# EAGLE schematic capacitance_touch_project (EAGLE 9.6.2)
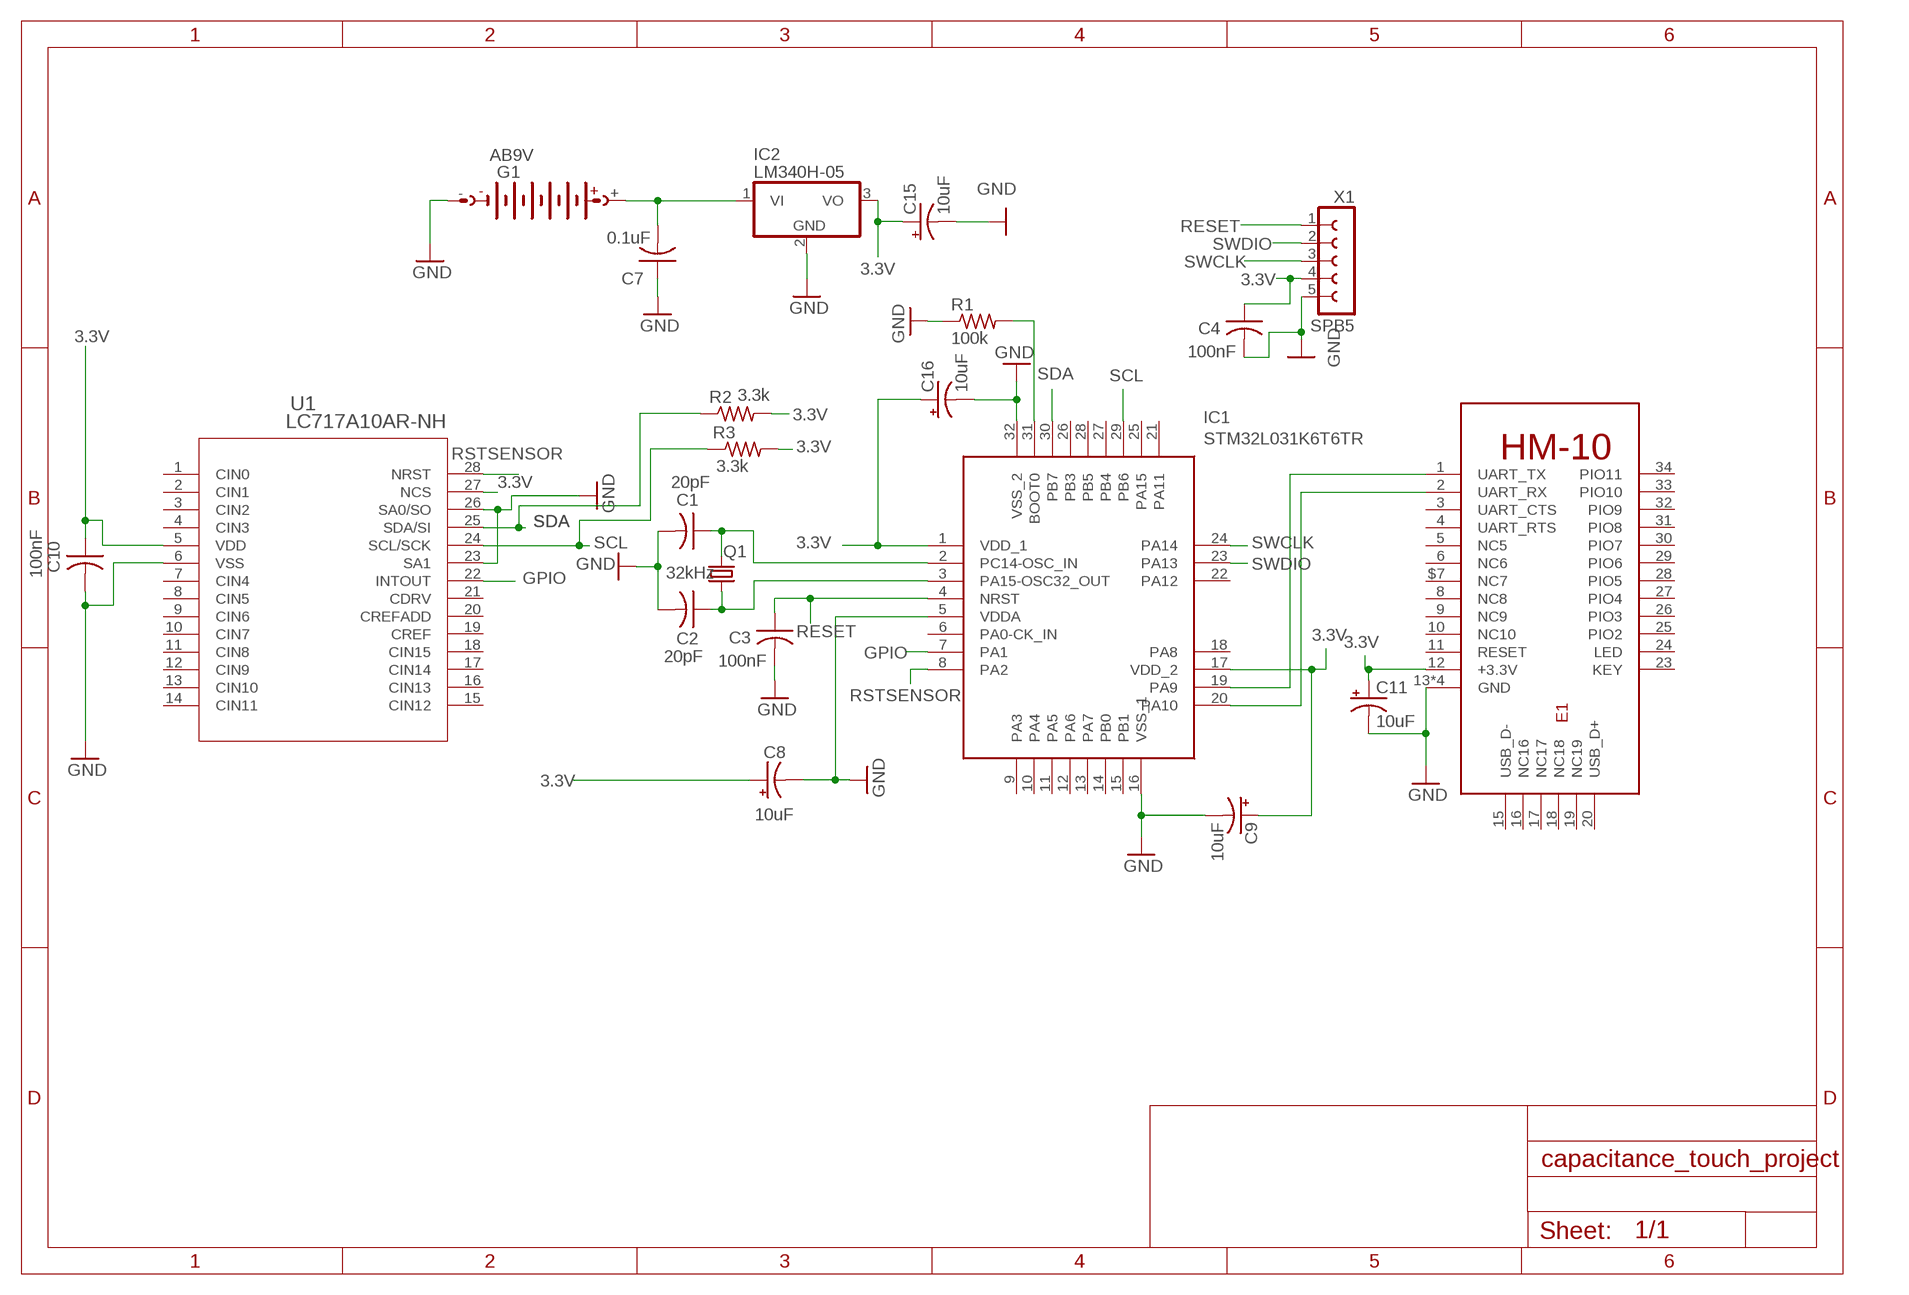
[diagram p0: schematic, sheet 1]

## Parts
C1  20pF  C-USC0805  [C0805]
C2  20pF  C-USC0805  [C0805]
C3  100nF  C-USC0805  [C0805]
C4  100nF  C-USC0805  [C0805]
C7  0.1uF  C-USC0805  [C0805]
C8  10uF  CPOL-USE2-5  [E2-5]
C9  10uF  CPOL-USE2-5  [E2-5]
C10  100nF  C-USC0805  [C0805]
C11  10uF  CPOL-USE2-5  [E2-5]
C15  10uF  CPOL-USE2-5  [E2-5]
C16  10uF  CPOL-USE2-5  [E2-5]
E1  HM-10-BOARD  [26.9X13X2.2_BOARD]
G1  AB9V  [AB9V]
IC1  STM32L031K6T6TR  [QFP80P900X900X160-32N]
IC2  LM340H-05  [TO220H]
Q1  32kHz  CRYSTALHC49S  [HC49/S]
R1  100k  R-US_0204/7  [0204/7]
R2  3.3k  R-US_0204/7  [0204/7]
R3  3.3k  R-US_0204/7  [0204/7]
U1  LC717A10AR-NH  [VCT28_3P5X3P5_ONS]
X1  SPB5  [SPB5]

## Nets
3.3V: C4.1 C8.+ C9.+ C10.1 C11.+ C15.+ C16.+ E1.12(+3.3V) IC1.1(VDD_1) IC1.17(VDD_2) IC2.3(VO) R2.2 R3.2 U1.5(VDD) U1.27(NCS) X1.4
GND: C1.2 C2.2 C3.2 C4.2 C7.1 C8.- C9.- C10.2 C11.- C15.- C16.- E1.13(GND) E1.14(GND) E1.21(GND) E1.22(GND) G1.- IC1.5(VDDA) IC1.16(VSS_1) IC1.32(VSS_2) IC2.2(GND) R1.1 U1.6(VSS) U1.23(SA1) U1.26(SA0/SO) X1.5
GPIO: IC1.7(PA1) U1.22(INTOUT)
N$1: C1.1 IC1.2(PC14-OSC_IN) Q1.2
N$2: C2.1 IC1.3(PA15-OSC32_OUT) Q1.1
N$4: C7.2 G1.+ IC2.1(VI)
N$8: E1.1(UART_TX) IC1.19(PA9)
N$9: IC1.31(BOOT0) R1.2
N$14: E1.2(UART_RX) IC1.20(PA10)
RESET: C3.1 IC1.4(NRST) X1.1
RSTSENSOR: IC1.8(PA2) U1.28(NRST)
SCL: IC1.29(PB6) R3.1 U1.24(SCL/SCK)
SDA: IC1.30(PB7) R2.1 U1.25(SDA/SI)
SWCLK: IC1.24(PA14) X1.3
SWDIO: IC1.23(PA13) X1.2
Unconnected: E1.3(UART_CTS) E1.4(UART_RTS) E1.5(NC5) E1.6(NC6) E1.8(NC8) E1.9(NC9) E1.10(NC10) E1.11(RESET) E1.15(USB_D-) E1.16(NC16) E1.17(NC17) E1.18(NC18) E1.19(NC19) E1.20(USB_D+) E1.23(KEY) E1.24(LED) E1.25(PIO2) E1.26(PIO3) E1.27(PIO4) E1.28(PIO5) E1.29(PIO6) E1.30(PIO7) E1.31(PIO8) E1.32(PIO9) E1.33(PIO10) E1.34(PIO11) E1.$7(NC7) IC1.6(PA0-CK_IN) IC1.9(PA3) IC1.10(PA4) IC1.11(PA5) IC1.12(PA6) IC1.13(PA7) IC1.14(PB0) IC1.15(PB1) IC1.18(PA8) IC1.21(PA11) IC1.22(PA12) IC1.25(PA15) IC1.26(PB3) IC1.27(PB4) IC1.28(PB5) U1.1(CIN0) U1.2(CIN1) U1.3(CIN2) U1.4(CIN3) U1.7(CIN4) U1.8(CIN5) U1.9(CIN6) U1.10(CIN7) U1.11(CIN8) U1.12(CIN9) U1.13(CIN10) U1.14(CIN11) U1.15(CIN12) U1.16(CIN13) U1.17(CIN14) U1.18(CIN15) U1.19(CREF) U1.20(CREFADD) U1.21(CDRV)

## Library data of the parts
C1-C4 C7 C10 = rcl:C-US: CAPACITOR, American symbol; SPICEPREFIX: C
C8 C9 C11 C15 C16 = rcl:CPOL-US: POLARIZED CAPACITOR, American symbol; SPICEPREFIX: C
E1 = hm10:HM-10: HM Bluetooth module use TI CC2540 or CC2541, Master and slave roles in one, transmission version and remote control version and PIO state acquisition functions in one, Support the AT command modify module parameters, Convenient and flexible.
G1 = battery:AB9V: 9-V BATTERY CLIP
IC1 = STM32L031K6T6TR:STM32L031K6T6TR: STMICROELECTRONICS - STM32L031K6T6TR - ARM MCU, STM32 Family STM32L0 Series Microcontrollers, ARM Cortex-M0+, 32bit, 32 MHz, 32 KB, 8 KB Source: Datasheet <https://4donline.ihs.com/images/VipMasterIC/IC/SGST/SGST-S-A0002219924/SGST-S-A0002219924-1.pdf?hkey=6D3A4C79FDBF58556ACFDE234799DDF0>; ARROW_PART_NUMBER: STM32L031K6T6TR; ARROW_PRICE-STOCK: https://www.arrow.com/en/products/stm32l031k6t6tr/stmicroelectronics; DESCRIPTION: STMICROELECTRONICS - STM32L031K6T6TR - ARM MCU, STM32 Family STM32L0 Series Microcontrollers, ARM Cortex-M0+, 32bit, 32 MHz, 32 KB, 8 KB; HEIGHT: 1.6mm; MANUFACTURER_NAME: STMicroelectronics; MANUFACTURER_PART_NUMBER: STM32L031K6T6TR; MOUSER_PART_NUMBER: 511-STM32L031K6T6TR; MOUSER_PRICE-STOCK: https://www.mouser.co.uk/ProductDetail/STMicroelectronics/STM32L031K6T6TR/?qs=xwQlLnDx56Cmxri8cgW0QQ%3D%3D
IC2 = linear:LM340?-*: Positive VOLTAGE REGULATOR Source: http://cache.national.com/ds/LM/LM340.pdf
Q1 = crystal:CRYSTAL: CRYSTAL; OC_FARNELL: 1667008; OC_NEWARK: unknown
R1-R3 = rcl:R-US_: RESISTOR, American symbol; SPICEPREFIX: R
U1 = LC717A10AR-NH:LC717A10AR-NH; BUILT_BY: EMA_April; COPYRIGHT: Copyright (C) 2018 Accelerated Designs. All rights reserved; MANUFACTURER_PART_NUMBER: LC717A10AR-NH; SOURCELIBRARY: OnSemi_2021-05-28_1; VENDOR: ON Semiconductor
X1 = con-hirschmann:SPB5: CONNECTOR 5 pins; OC_FARNELL: unknown; OC_NEWARK: unknown